# Altium schematic sheet DemodTeensy.SchDoc
size A4; SheetNumber: 3; SheetTotal: 6
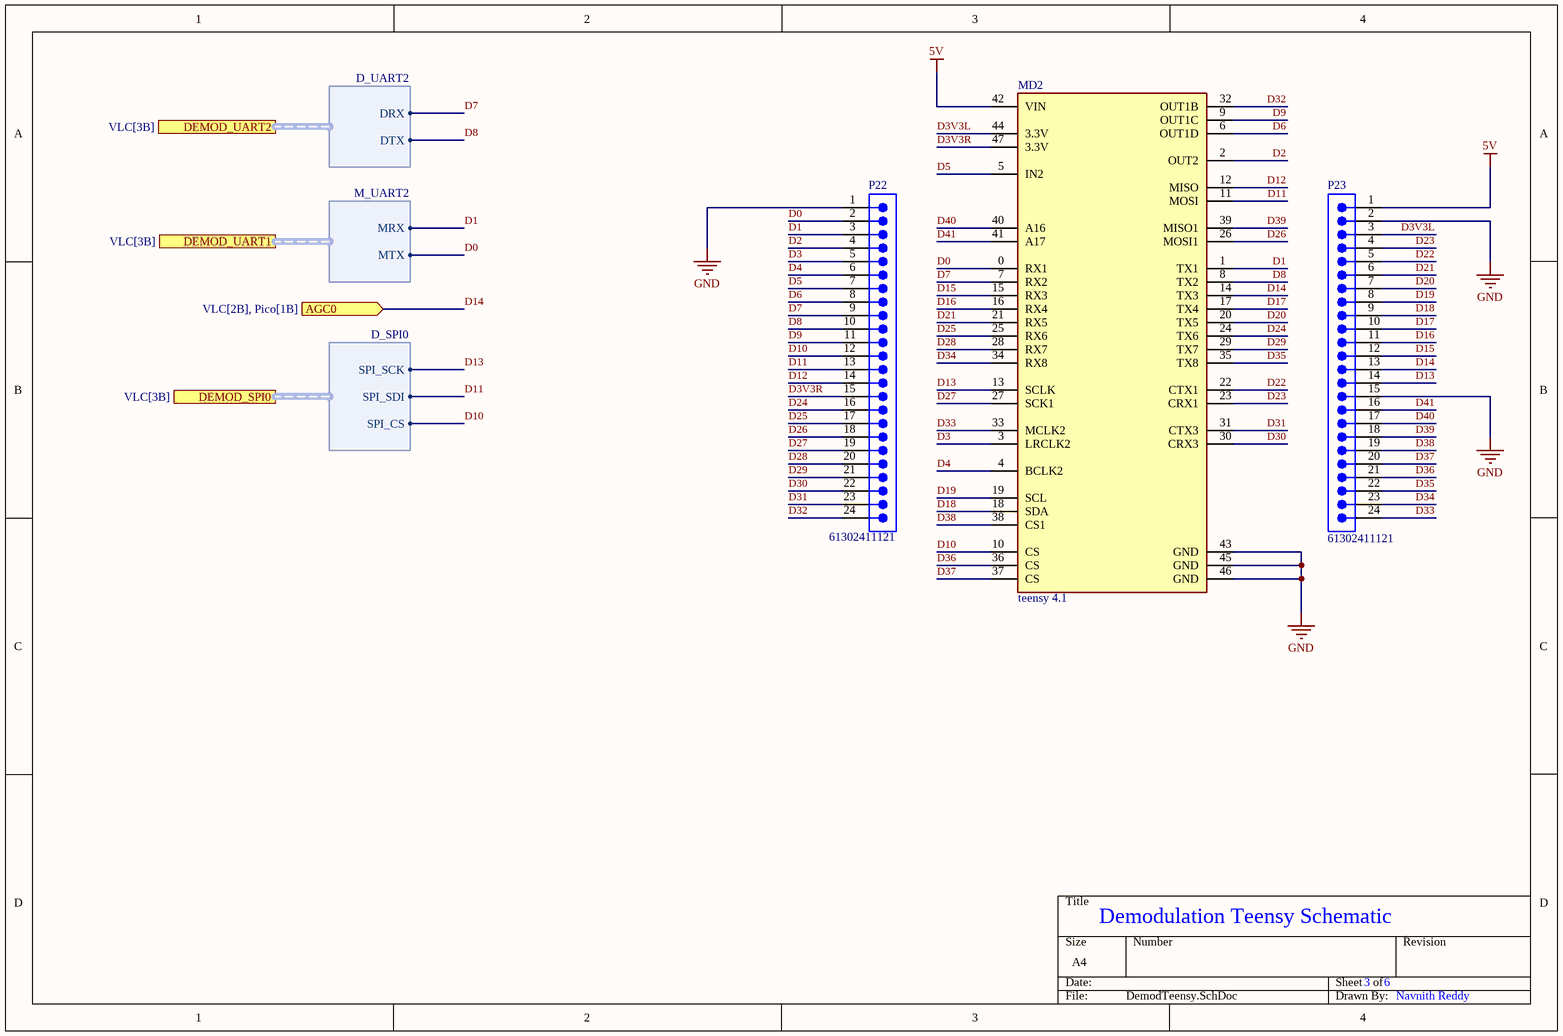
[diagram p0: DemodTeensy.SchDoc]

## Parts
MD2  teensy 4.1  [FP-DEV-16996-MFG]
P22  61302411121  [61302411121]
P23  61302411121  [61302411121]

## Ports
AGC0 (in, see VLC[2B], Pico[1B]), DEMOD_SPI0 (harness D_SPI0, see VLC[3B]), DEMOD_UART1 (harness M_UART2, see VLC[3B]), DEMOD_UART2 (harness D_UART2, see VLC[3B])

## Harnesses
D_SPI0: SPI_SCK, SPI_SDI, SPI_CS
M_UART2: MRX, MTX
D_UART2: DRX, DTX

## Nets
5V: MD2.42(VIN) P23.1
GND: MD2.43(GND) MD2.45(GND) MD2.46(GND) P22.1 P23.2 P23.15
D0: MD2.0(RX1) P22.2 ; port DEMOD_UART1.MTX
D1: MD2.1(TX1) P22.3 ; port DEMOD_UART1.MRX
D2: MD2.2(OUT2) P22.4
D3: MD2.3(LRCLK2) P22.5
D3V3L: MD2.44(3.3V) P23.3
D3V3R: MD2.47(3.3V) P22.15
D4: MD2.4(BCLK2) P22.6
D5: MD2.5(IN2) P22.7
D6: MD2.6(OUT1D) P22.8
D7: MD2.7(RX2) P22.9 ; port DEMOD_UART2.DRX
D8: MD2.8(TX2) P22.10 ; port DEMOD_UART2.DTX
D9: MD2.9(OUT1C) P22.11
D10: MD2.10(CS) P22.12 ; port DEMOD_SPI0.SPI_CS
D11: MD2.11(MOSI) P22.13 ; port DEMOD_SPI0.SPI_SDI
D12: MD2.12(MISO) P22.14
D13: MD2.13(SCLK) P23.14 ; port DEMOD_SPI0.SPI_SCK
D14: MD2.14(TX3) P23.13 ; port AGC0
D15: MD2.15(RX3) P23.12
D16: MD2.16(RX4) P23.11
D17: MD2.17(TX4) P23.10
D18: MD2.18(SDA) P23.9
D19: MD2.19(SCL) P23.8
D20: MD2.20(TX5) P23.7
D21: MD2.21(RX5) P23.6
D22: MD2.22(CTX1) P23.5
D23: MD2.23(CRX1) P23.4
D24: MD2.24(TX6) P22.16
D25: MD2.25(RX6) P22.17
D26: MD2.26(MOSI1) P22.18
D27: MD2.27(SCK1) P22.19
D28: MD2.28(RX7) P22.20
D29: MD2.29(TX7) P22.21
D30: MD2.30(CRX3) P22.22
D31: MD2.31(CTX3) P22.23
D32: MD2.32(OUT1B) P22.24
D33: MD2.33(MCLK2) P23.24
D34: MD2.34(RX8) P23.23
D35: MD2.35(TX8) P23.22
D36: MD2.36(CS) P23.21
D37: MD2.37(CS) P23.20
D38: MD2.38(CS1) P23.19
D39: MD2.39(MISO1) P23.18
D40: MD2.40(A16) P23.17
D41: MD2.41(A17) P23.16

## Notes on the sheet
- Demodulation Teensy Schematic
- 3
- 6
- Navnith Reddy

## Library data of the parts
MD2 = CMP-157412-000001-1: TEENSY 4.1 (HEADERS)
P22 P23 = CMP-1502-01109-2: NexarPartId: 32855561; Number of Contacts: 24; Connector Type: Male Pin; Operating Supply Voltage: 250V; Pitch: 2.54mm; Gender: Male; Current Rating: 3A; Contact Resistance: 20mΩ; Mount: Through Hole; Contact Plating: Gold; Lead Pitch: 2.54mm; Orientation: Vertical; Color: Black; Packaging: Bulk; REACH SVHC: Unknown; Termination: Solder; Number of Positions: 24; RoHS: Compliant; Contact Mating Length: 5.9944mm; Number of Pins: 24; Contact Material: Copper; Number of Rows: 1